# Altium schematic sheet ThermalType_Arduino_v0.1.SchDoc: ThermalTypewriter Arduino ver. 0.1
size A4; DrawnBy: Wang Xiaolei; DocumentFullPathAndName: ThermalType_Arduino_v0.1.SchDoc
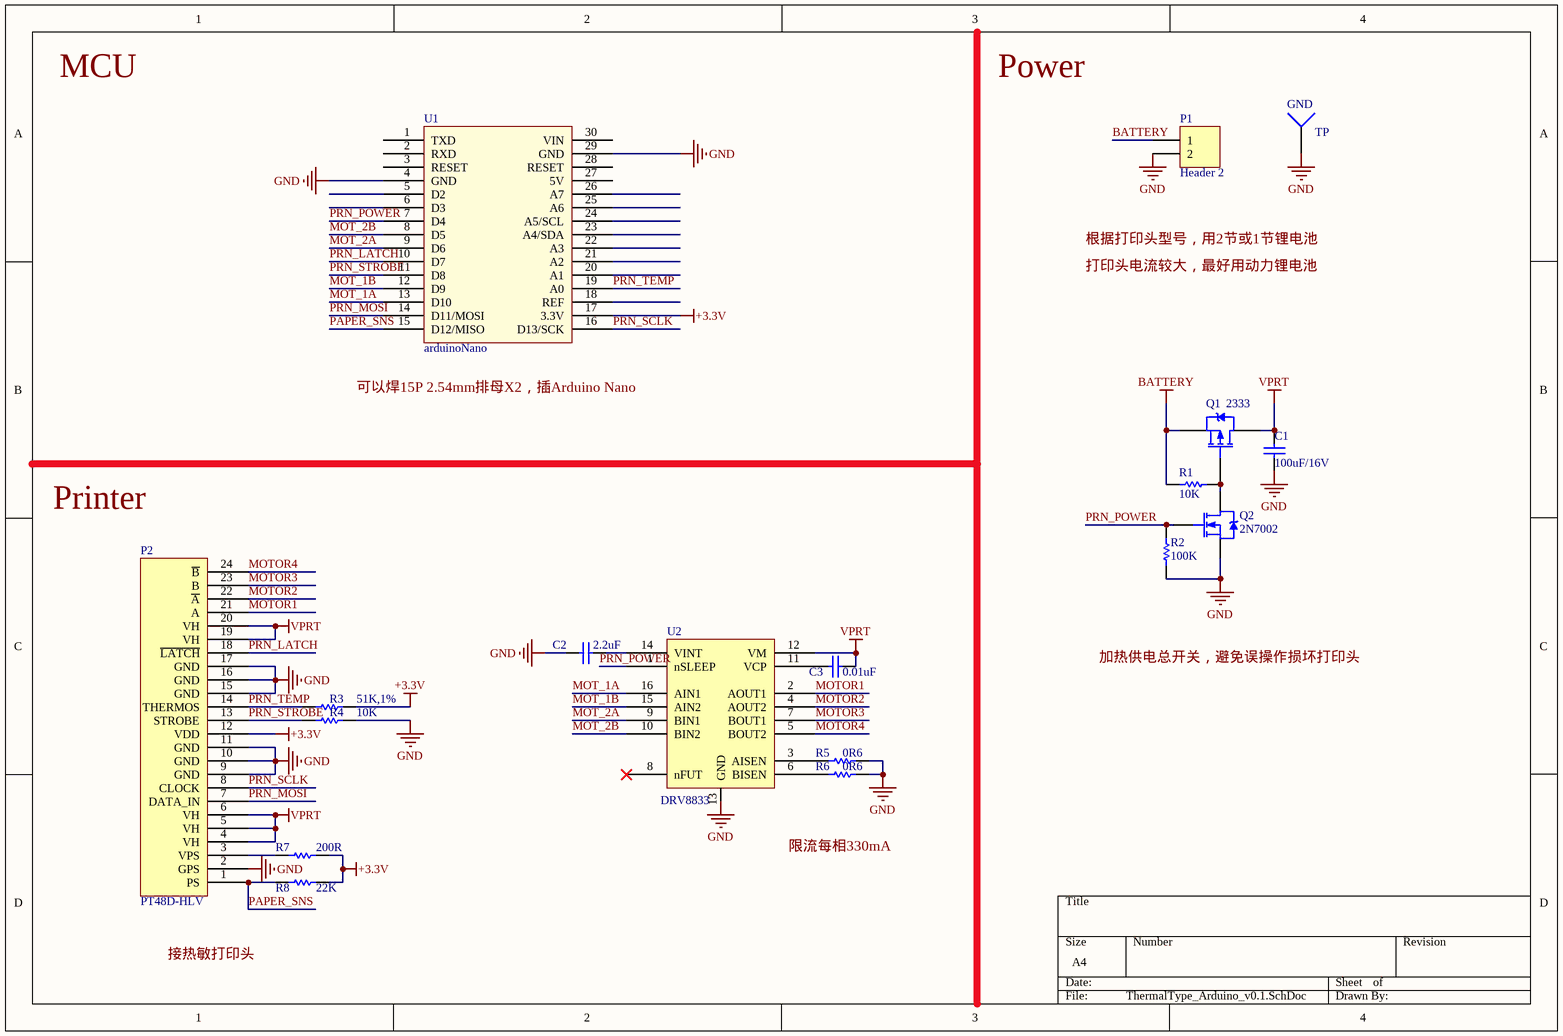
[diagram p0: ThermalType_Arduino_v0.1.SchDoc]

## Parts
C1  100uF/16V  [CAP6.3*5.5]
C2  2.2uF  [LC-0603_C]
C3  0.01uF  [LC-0603_C]
GND  TP  [TP]  (no BOM)
P1  Header 2  [YX-XH-2-2.54-90]
P2  PT48D-HLV
Q1  2333  [LC-SOT-23(SOT-23-3)]
Q2  2N7002  [LC-SOT-23(SOT-23-3)]
R1  10K  [LC-0603_R]
R2  100K  [LC-0603_R]
R3  51K,1%  [LC-0603_R]
R4  10K  [LC-0603_R]
R5  0R6  [LC-0805_R]
R6  0R6  [LC-0805_R]
R7  200R  [LC-0603_R]
R8  22K  [LC-0603_R]
U1  arduinoNano  [Arduino nano]
U2  DRV8833  [HTSSOP-16]

## Nets
+3.3V: P2.12(VDD) R3.2 R7.2 R8.2 U1.17(3.3V)
BATTERY: P1.1 Q1.3(S) R1.2
GND: C1.2 C2.2 GND.1 P1.2 P2.2(GPS) P2.9(GND) P2.10(GND) P2.11(GND) P2.15(GND) P2.16(GND) P2.17(GND) Q2.2(S) R2.2 R4.2 R5.1 R6.1 U1.4(GND) U1.29(GND) U2.13(GND)
VPRT: C1.1 C3.1 P2.4(VH) P2.5(VH) P2.6(VH) P2.19(VH) P2.20(VH) Q1.2(D) U2.12(VM)
MOT_1A: U1.13(D10) U2.16(AIN1)
MOT_1B: U1.12(D9) U2.15(AIN2)
MOT_2A: U1.9(D6) U2.9(BIN1)
MOT_2B: U1.8(D5) U2.10(BIN2)
MOTOR1: P2.21(A) U2.2(AOUT1)
MOTOR2: P2.22(~{A}) U2.4(AOUT2)
MOTOR3: P2.23(B) U2.7(BOUT1)
MOTOR4: P2.24(~{B}) U2.5(BOUT2)
PAPER_SNS: P2.1(PS) R8.1 U1.15(D12/MISO)
PRN_LATCH: P2.18(~{LATCH}) U1.10(D7)
PRN_MOSI: P2.7(DATA_IN) U1.14(D11/MOSI)
PRN_POWER: Q2.1(G) R2.1 U1.7(D4) U2.1(nSLEEP)
PRN_SCLK: P2.8(CLOCK) U1.16(D13/SCK)
PRN_STROBE: P2.13(STROBE) R4.1 U1.11(D8)
PRN_TEMP: P2.14(THERMOS) R3.1 U1.19(A0)
NetC2_1: C2.1 U2.14(VINT)
NetC3_2: C3.2 U2.11(VCP)
NetP2_3: P2.3(VPS) R7.1
NetQ1_1: Q1.1(G) Q2.3(D) R1.1
NetR5_2: R5.2 U2.3(AISEN)
NetR6_2: R6.2 U2.6(BISEN)

Not connected (* = marked no-connect by the designer): U1 1(TXD) 2(RXD) 3(RESET) 5(D2) 6(D3) 18(REF) 20(A1) 21(A2) 22(A3) 23(A4/SDA) 24(A5/SCL) 25(A6) 26(A7) 27(5V) 28(RESET) 30(VIN); U2 8(nFUT)*

## Notes on the sheet
- MCU
- Power
- 根据打印头型号，用2节或1节锂电池
- 打印头电流较大，最好用动力锂电池
- (near U1) 可以焊15P 2.54mm排母X2，插Arduino Nano
- Printer
- 加热供电总开关，避免误操作损坏打印头
- 限流每相330mA
- 接热敏打印头

## Library data of the parts
C1-C3 = 0603C
GND = Socket: LatestRevisionDate: 17-Jul-2002; LatestRevisionNote: Re-released for DXP Platform.; Publisher: Altium Limited
P1 = Header 2: Header, 2-Pin; LatestRevisionDate: 17-Jul-2002; LatestRevisionNote: Re-released for DXP Platform.; Publisher: Altium Limited
Q1 = CJ2333: P-MOS; pin to pad: 2>3 3>2
Q2 = NMOS-2: N-Channel Power MOSFET; Note: Pin 2 is electrically connected to pin 4.; Published: 8-Jun-2000; LatestRevisionDate: 17-Jul-2002; LatestRevisionNote: Re-released for DXP Platform.; DatasheetDocument: PD-9.814; PackageReference: TO-220AB; Publisher: Altium Limited; Code_JEDEC: TO-220-AB; ComponentLink1Description: Manufacturer Link; ComponentLink1URL: http://www.irf.com/
R1-R8 = 0603R